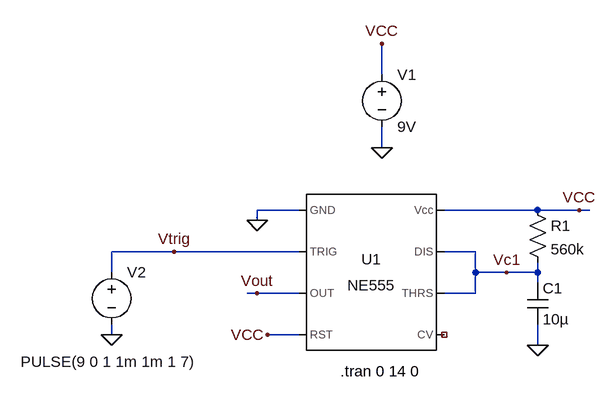
[diagram p0: schematic Monostable.asc]
Monostable.asc, the LTspice schematic file:
Version 4
SHEET 1 3020 680
WIRE 2096 -1152 2096 -1200
WIRE 2096 -1040 2096 -1072
WIRE 1968 -944 1904 -944
WIRE 2336 -944 2192 -944
WIRE 2400 -944 2336 -944
WIRE 2416 -944 2400 -944
WIRE 1904 -928 1904 -944
WIRE 1776 -880 1680 -880
WIRE 1968 -880 1776 -880
WIRE 2240 -880 2192 -880
WIRE 1680 -848 1680 -880
WIRE 2240 -848 2240 -880
WIRE 2288 -848 2240 -848
WIRE 2336 -848 2336 -864
WIRE 2336 -848 2288 -848
WIRE 2336 -832 2336 -848
WIRE 1904 -816 1888 -816
WIRE 1968 -816 1904 -816
WIRE 2240 -816 2240 -848
WIRE 2240 -816 2192 -816
WIRE 1680 -752 1680 -768
WIRE 1968 -752 1920 -752
WIRE 2336 -736 2336 -768
FLAG 2096 -1040 0
FLAG 2096 -1200 VCC
FLAG 1904 -928 0
FLAG 2336 -736 0
FLAG 2400 -944 VCC
FLAG 1920 -752 VCC
FLAG 1680 -752 0
FLAG 1904 -816 Vout
FLAG 1776 -880 Vtrig
FLAG 2288 -848 Vc1
SYMBOL Misc\\NE555 2080 -848 R0
SYMATTR InstName U1
SYMBOL voltage 2096 -1168 R0
SYMATTR InstName V1
SYMATTR Value 9V
SYMBOL res 2320 -960 R0
SYMATTR InstName R1
SYMATTR Value 560k
SYMBOL cap 2320 -832 R0
SYMATTR InstName C1
SYMATTR Value 10µ
SYMBOL voltage 1680 -864 R0
WINDOW 3 -140 153 Left 2
WINDOW 123 0 0 Left 2
WINDOW 39 0 0 Left 2
SYMATTR InstName V2
SYMATTR Value PULSE(9 0 1 1m 1m 1 7)
TEXT 2032 -696 Left 2 !.tran 0 14 0

The netlist it stands for:
* Monostable.asc
XU1 0 Vtrig Vout VCC NC_01 Vc1 Vc1 VCC NE555  ; pins GND TRIG OUT RST CV THRS DIS Vcc
V1 VCC 0 9V
R1 VCC Vc1 560k
C1 Vc1 0 10µ
V2 Vtrig 0 PULSE(9 0 1 1m 1m 1 7)
.tran 0 14 0
.lib NE555.sub
.backanno
.end

* Results of the author's LTspice run, read from the files saved beside the schematic
* Operating Point, zero values left out:
*   V(vtrig) = 9 V
*   V(vcc) = 9 V
*   V(vc1) = 8.988 V
*   V(vout) = 9 V
*   I(R1) = 20.98 nA
*   I(V2) = -9 nA
*   I(V1) = -2.908 mA
*   Ix(u1:1) = -2.908 mA
*   Ix(u1:2) = 9 nA
*   Ix(u1:4) = 49.33 µA
*   Ix(u1:6) = 8.988 nA
*   Ix(u1:7) = 11.99 nA
*   Ix(u1:8) = 2.859 mA
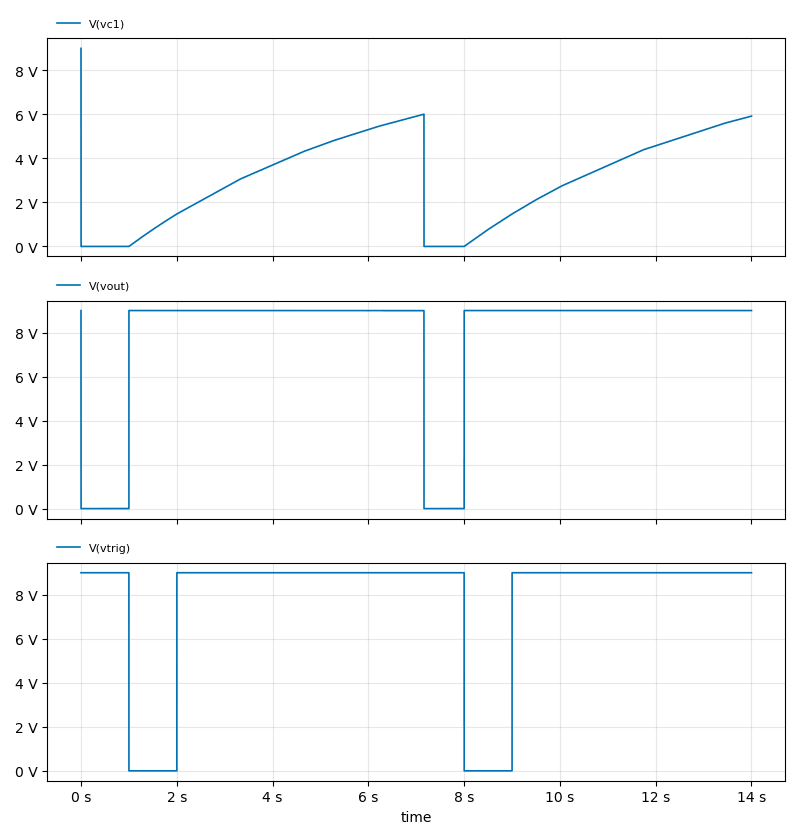
[diagram p1: Transient Analysis of Monostable.asc, plotted from the saved traces]
* Transient Analysis, 1 run:
*   V(vc1): min 96.43 µV, max 8.988 V, average 3.031 V, rms 3.642 V, last 5.914 V
*   V(vout): min 54 µV, max 9 V, average 7.817 V, rms 8.388 V, last 9 V
*   V(vtrig): min 0 V, max 9 V, average 7.713 V, rms 8.332 V, last 9 V